# Altium schematic sheet Top.SchDoc
size A
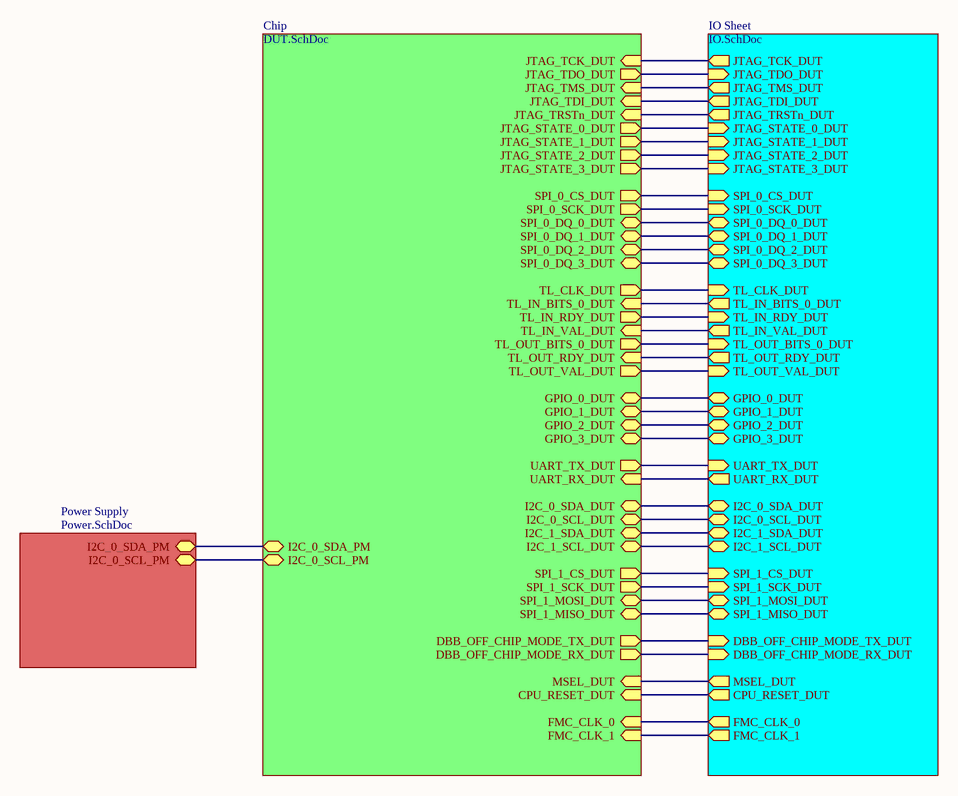
[diagram p0: Top.SchDoc]

## Sub-sheets
Chip = DUT.SchDoc: JTAG_TCK_DUT (in), JTAG_TDO_DUT (out), JTAG_TMS_DUT (in), JTAG_TDI_DUT (in), JTAG_TRSTn_DUT (in), JTAG_STATE_0_DUT (out), JTAG_STATE_1_DUT (out), JTAG_STATE_2_DUT (out), JTAG_STATE_3_DUT (out), TL_CLK_DUT (out), SPI_0_CS_DUT (out), SPI_0_SCK_DUT (out), SPI_0_DQ_0_DUT (bidir), SPI_0_DQ_1_DUT (bidir), SPI_0_DQ_2_DUT (bidir), SPI_0_DQ_3_DUT (bidir), TL_IN_BITS_0_DUT (in), TL_IN_RDY_DUT (out), TL_IN_VAL_DUT (in), TL_OUT_BITS_0_DUT (out), TL_OUT_RDY_DUT (in), TL_OUT_VAL_DUT (out), GPIO_1_DUT (bidir), GPIO_0_DUT (bidir), GPIO_2_DUT (bidir), GPIO_3_DUT (bidir), UART_TX_DUT (out), UART_RX_DUT (in), I2C_0_SDA_DUT (bidir), I2C_0_SCL_DUT (bidir), I2C_1_SDA_DUT (bidir), I2C_1_SCL_DUT (bidir), SPI_1_CS_DUT (out), SPI_1_SCK_DUT (out), SPI_1_MOSI_DUT (bidir), SPI_1_MISO_DUT (bidir), DBB_OFF_CHIP_MODE_RX_DUT (out), DBB_OFF_CHIP_MODE_TX_DUT (out), I2C_0_SDA_PM (bidir), I2C_0_SCL_PM (bidir), MSEL_DUT (in), CPU_RESET_DUT (in), FMC_CLK_0 (in), FMC_CLK_1 (in)
IO Sheet = IO.SchDoc: JTAG_TCK_DUT (out), JTAG_TDO_DUT (in), JTAG_TMS_DUT (out), JTAG_TDI_DUT (out), JTAG_TRSTn_DUT (out), JTAG_STATE_0_DUT (in), JTAG_STATE_1_DUT (in), JTAG_STATE_2_DUT (in), JTAG_STATE_3_DUT (in), SPI_0_CS_DUT (in), SPI_0_SCK_DUT (in), SPI_0_DQ_0_DUT (bidir), SPI_0_DQ_1_DUT (bidir), SPI_0_DQ_2_DUT (bidir), SPI_0_DQ_3_DUT (bidir), TL_CLK_DUT (in), TL_IN_BITS_0_DUT (out), TL_IN_RDY_DUT (in), TL_IN_VAL_DUT (out), TL_OUT_BITS_0_DUT (in), TL_OUT_RDY_DUT (out), TL_OUT_VAL_DUT (in), GPIO_1_DUT (bidir), GPIO_0_DUT (bidir), GPIO_2_DUT (bidir), GPIO_3_DUT (bidir), UART_TX_DUT (in), UART_RX_DUT (out), I2C_0_SDA_DUT (bidir), I2C_0_SCL_DUT (bidir), I2C_1_SDA_DUT (bidir), I2C_1_SCL_DUT (bidir), SPI_1_CS_DUT (in), SPI_1_SCK_DUT (in), SPI_1_MOSI_DUT (bidir), SPI_1_MISO_DUT (bidir), DBB_OFF_CHIP_MODE_RX_DUT (in), DBB_OFF_CHIP_MODE_TX_DUT (in), MSEL_DUT (out), CPU_RESET_DUT (out), FMC_CLK_0 (out), FMC_CLK_1 (out)
Power Supply = Power.SchDoc: I2C_0_SDA_PM (bidir), I2C_0_SCL_PM (bidir)

## Nets
(unnamed): sheet Chip/JTAG_TCK_DUT, sheet IO Sheet/JTAG_TCK_DUT
(unnamed): sheet Chip/JTAG_TDO_DUT, sheet IO Sheet/JTAG_TDO_DUT
(unnamed): sheet Chip/JTAG_TMS_DUT, sheet IO Sheet/JTAG_TMS_DUT
(unnamed): sheet Chip/JTAG_TDI_DUT, sheet IO Sheet/JTAG_TDI_DUT
(unnamed): sheet Chip/JTAG_TRSTn_DUT, sheet IO Sheet/JTAG_TRSTn_DUT
(unnamed): sheet Chip/JTAG_STATE_0_DUT, sheet IO Sheet/JTAG_STATE_0_DUT
(unnamed): sheet Chip/JTAG_STATE_1_DUT, sheet IO Sheet/JTAG_STATE_1_DUT
(unnamed): sheet Chip/JTAG_STATE_2_DUT, sheet IO Sheet/JTAG_STATE_2_DUT
(unnamed): sheet Chip/JTAG_STATE_3_DUT, sheet IO Sheet/JTAG_STATE_3_DUT
(unnamed): sheet Chip/TL_CLK_DUT, sheet IO Sheet/TL_CLK_DUT
(unnamed): sheet Chip/SPI_0_CS_DUT, sheet IO Sheet/SPI_0_CS_DUT
(unnamed): sheet Chip/SPI_0_SCK_DUT, sheet IO Sheet/SPI_0_SCK_DUT
(unnamed): sheet Chip/SPI_0_DQ_0_DUT, sheet IO Sheet/SPI_0_DQ_0_DUT
(unnamed): sheet Chip/SPI_0_DQ_1_DUT, sheet IO Sheet/SPI_0_DQ_1_DUT
(unnamed): sheet Chip/SPI_0_DQ_2_DUT, sheet IO Sheet/SPI_0_DQ_2_DUT
(unnamed): sheet Chip/SPI_0_DQ_3_DUT, sheet IO Sheet/SPI_0_DQ_3_DUT
(unnamed): sheet Chip/TL_IN_BITS_0_DUT, sheet IO Sheet/TL_IN_BITS_0_DUT
(unnamed): sheet Chip/TL_IN_RDY_DUT, sheet IO Sheet/TL_IN_RDY_DUT
(unnamed): sheet Chip/TL_IN_VAL_DUT, sheet IO Sheet/TL_IN_VAL_DUT
(unnamed): sheet Chip/TL_OUT_BITS_0_DUT, sheet IO Sheet/TL_OUT_BITS_0_DUT
(unnamed): sheet Chip/TL_OUT_RDY_DUT, sheet IO Sheet/TL_OUT_RDY_DUT
(unnamed): sheet Chip/TL_OUT_VAL_DUT, sheet IO Sheet/TL_OUT_VAL_DUT
(unnamed): sheet Chip/GPIO_1_DUT, sheet IO Sheet/GPIO_1_DUT
(unnamed): sheet Chip/GPIO_0_DUT, sheet IO Sheet/GPIO_0_DUT
(unnamed): sheet Chip/GPIO_2_DUT, sheet IO Sheet/GPIO_2_DUT
(unnamed): sheet Chip/GPIO_3_DUT, sheet IO Sheet/GPIO_3_DUT
(unnamed): sheet Chip/UART_TX_DUT, sheet IO Sheet/UART_TX_DUT
(unnamed): sheet Chip/UART_RX_DUT, sheet IO Sheet/UART_RX_DUT
(unnamed): sheet Chip/I2C_0_SDA_DUT, sheet IO Sheet/I2C_0_SDA_DUT
(unnamed): sheet Chip/I2C_0_SCL_DUT, sheet IO Sheet/I2C_0_SCL_DUT
(unnamed): sheet Chip/I2C_1_SDA_DUT, sheet IO Sheet/I2C_1_SDA_DUT
(unnamed): sheet Chip/I2C_1_SCL_DUT, sheet IO Sheet/I2C_1_SCL_DUT
(unnamed): sheet Chip/SPI_1_CS_DUT, sheet IO Sheet/SPI_1_CS_DUT
(unnamed): sheet Chip/SPI_1_SCK_DUT, sheet IO Sheet/SPI_1_SCK_DUT
(unnamed): sheet Chip/SPI_1_MOSI_DUT, sheet IO Sheet/SPI_1_MOSI_DUT
(unnamed): sheet Chip/SPI_1_MISO_DUT, sheet IO Sheet/SPI_1_MISO_DUT
(unnamed): sheet Chip/DBB_OFF_CHIP_MODE_RX_DUT, sheet IO Sheet/DBB_OFF_CHIP_MODE_RX_DUT
(unnamed): sheet Chip/DBB_OFF_CHIP_MODE_TX_DUT, sheet IO Sheet/DBB_OFF_CHIP_MODE_TX_DUT
(unnamed): sheet Chip/I2C_0_SDA_PM, sheet Power Supply/I2C_0_SDA_PM
(unnamed): sheet Chip/I2C_0_SCL_PM, sheet Power Supply/I2C_0_SCL_PM
(unnamed): sheet Chip/MSEL_DUT, sheet IO Sheet/MSEL_DUT
(unnamed): sheet Chip/CPU_RESET_DUT, sheet IO Sheet/CPU_RESET_DUT
(unnamed): sheet Chip/FMC_CLK_0, sheet IO Sheet/FMC_CLK_0
(unnamed): sheet Chip/FMC_CLK_1, sheet IO Sheet/FMC_CLK_1